# Altium project GrandMini_v1.PrjPcb (part 1 of 3)
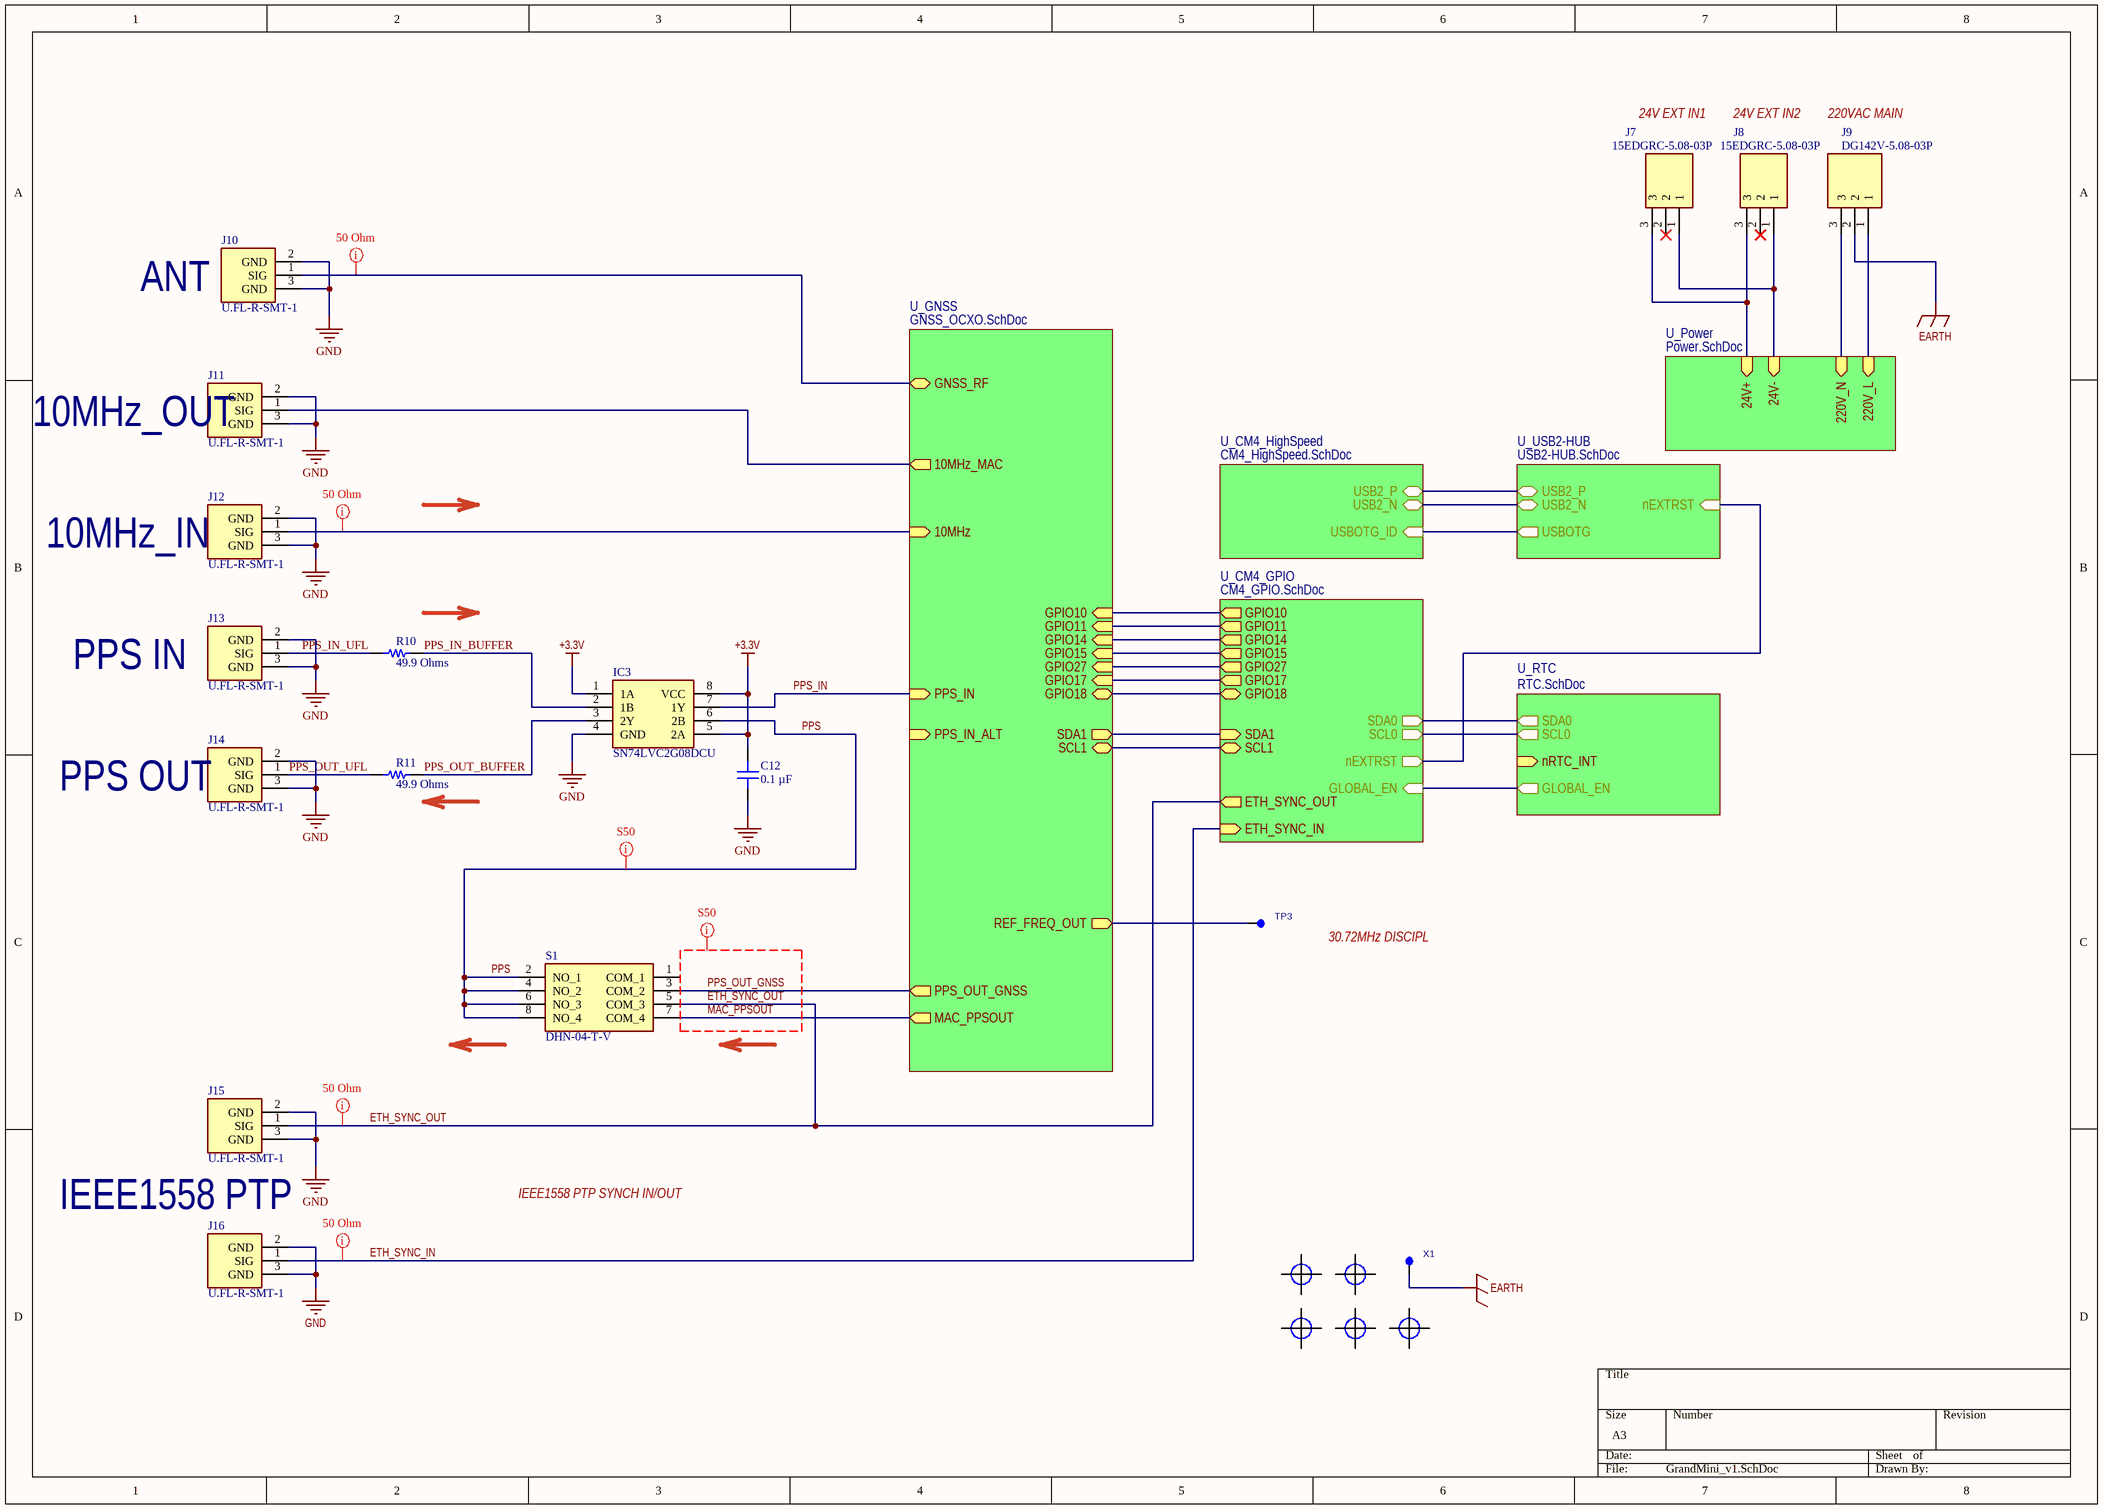
[diagram p0: GrandMini_v1.SchDoc]
TENSH_PCB: ТЕНШ.467883.02.11.001; TENSH_FAB: ТЕНШ.467883.02.11.000; revision: rev.1.0; company: SHIWA  NETWORK
7 sheets, 214 parts. Net scope: hierarchical (ports join the sheet entries above them; power ports are global).
Board file: GrandMini_v1.PcbDoc
Sheets:
  GrandMini_v1.SchDoc
    U_Power = Power.SchDoc
    U_CM4_GPIO = CM4_GPIO.SchDoc
    U_CM4_HighSpeed = CM4_HighSpeed.SchDoc
    U_RTC = RTC.SchDoc
    U_USB2-HUB = USB2-HUB.SchDoc
    U_GNSS = GNSS_OCXO.SchDoc

## Sheet GrandMini_v1.SchDoc
size A3; DocumentNumber: 1; SheetNumber: 1

### Parts
C12  0.1 µF  [CAP 0603_1608]
IC3  SN74LVC2G08DCU  [SOP50P310X90-8N]
J7  15EDGRC-5.08-03P  [15EDGRC-5.08-03P]
J8  15EDGRC-5.08-03P  [15EDGRC-5.08-03P]
J9  DG142V-5.08-03P  [DG142V-5.08-03P]
J10  U.FL-R-SMT-1  [U.FL-R-SMT-1]
J11  U.FL-R-SMT-1  [U.FL-R-SMT-1]
J12  U.FL-R-SMT-1  [U.FL-R-SMT-1]
J13  U.FL-R-SMT-1  [U.FL-R-SMT-1]
J14  U.FL-R-SMT-1  [U.FL-R-SMT-1]
J15  U.FL-R-SMT-1  [U.FL-R-SMT-1]
J16  U.FL-R-SMT-1  [U.FL-R-SMT-1]
MNT1  MOUNT_HOLE  [MOUNT_3.5mm]  (value not drawn)  (no BOM)
MNT2  MOUNT_HOLE  [MOUNT_3.5mm]  (value not drawn)  (no BOM)
MNT4  MOUNT_HOLE  [MOUNT_3.5mm]  (value not drawn)  (no BOM)
MNT5  MOUNT_HOLE  [MOUNT_3.5mm]  (value not drawn)  (no BOM)
MNT6  MOUNT_HOLE  [MOUNT_3.5mm]  (value not drawn)  (no BOM)
R10  49.9 Ohms  [YAGEO RES 0603_1608]
R11  49.9 Ohms  [YAGEO RES 0603_1608]
S1  DHN-04-T-V  [DHN04TV]
TP3  30.72MHz  [PAD_TEST]  (value not drawn)  (no BOM)
X1  PAD  [POWERPAD_ROU_7/3.2]  (value not drawn)  (no BOM)

### Sub-sheets
U_CM4_GPIO = CM4_GPIO.SchDoc: GLOBAL_EN (in), SCL0 (out), SDA0 (out), nEXTRST (out), SDA1 (in), SCL1 (bidir), ETH_SYNC_IN (in), ETH_SYNC_OUT (out), GPIO10 (out), GPIO11 (out), GPIO14 (out), GPIO15 (out), GPIO27 (out), GPIO17 (out), GPIO18 (bidir)
U_CM4_HighSpeed = CM4_HighSpeed.SchDoc: USBOTG_ID (in), USB2_P (bidir), USB2_N (bidir)
U_GNSS = GNSS_OCXO.SchDoc: 10MHz (in), GNSS_RF (bidir), PPS_IN_ALT (in), PPS_IN (in), GPIO17 (in), GPIO27 (in), GPIO11 (in), GPIO10 (in), REF_FREQ_OUT (out), PPS_OUT_GNSS (out), MAC_PPSOUT (out), GPIO15 (in), GPIO14 (in), GPIO18 (bidir), SDA1 (out), SCL1 (bidir), 10MHz_MAC (out)
U_Power = Power.SchDoc: 220V_L (in), 220V_N (in), 24V+ (in), 24V- (in)
U_RTC = RTC.SchDoc: SCL0 (out), SDA0 (out), GLOBAL_EN (out), nRTC_INT (in)
U_USB2-HUB = USB2-HUB.SchDoc: USB2_N (bidir), USBOTG (out), USB2_P (bidir), nEXTRST (in)

### Nets
+3.3V: C12.2 IC3.1(1A) IC3.5(2A) IC3.8(VCC)
EARTH: J9.2 X1.1
GND: C12.1 IC3.4(GND) J10.2(GND) J10.3(GND) J11.2(GND) J11.3(GND) J12.2(GND) J12.3(GND) J13.2(GND) J13.3(GND) J14.2(GND) J14.3(GND) J15.2(GND) J15.3(GND) J16.2(GND) J16.3(GND)
GND_ISO: J7.1 J8.1 ; sheet U_Power/24V-
10MHz: J12.1(SIG) ; sheet U_GNSS/10MHz
10MHz_MAC: J11.1(SIG) ; sheet U_GNSS/10MHz_MAC
24V+: J7.3 J8.3 ; sheet U_Power/24V+
220V_L: J9.1 ; sheet U_Power/220V_L
220V_N: J9.3 ; sheet U_Power/220V_N
ETH_SYNC_IN: J16.1(SIG) ; sheet U_CM4_GPIO/ETH_SYNC_IN
ETH_SYNC_OUT: J15.1(SIG) S1.5(COM_3) ; sheet U_CM4_GPIO/ETH_SYNC_OUT
GLOBAL_EN: sheet U_CM4_GPIO/GLOBAL_EN, sheet U_RTC/GLOBAL_EN
GNSS_RF_IN: J10.1(SIG) ; sheet U_GNSS/GNSS_RF
GPIO10: sheet U_CM4_GPIO/GPIO10, sheet U_GNSS/GPIO10
GPIO11: sheet U_CM4_GPIO/GPIO11, sheet U_GNSS/GPIO11
GPIO14: sheet U_CM4_GPIO/GPIO14, sheet U_GNSS/GPIO14
GPIO15: sheet U_CM4_GPIO/GPIO15, sheet U_GNSS/GPIO15
GPIO17: sheet U_CM4_GPIO/GPIO17, sheet U_GNSS/GPIO17
GPIO18: sheet U_CM4_GPIO/GPIO18, sheet U_GNSS/GPIO18
GPIO27: sheet U_CM4_GPIO/GPIO27, sheet U_GNSS/GPIO27
MAC_PPSOUT: S1.7(COM_4) ; sheet U_GNSS/MAC_PPSOUT
nEXTRST: sheet U_CM4_GPIO/nEXTRST, sheet U_USB2-HUB/nEXTRST
PPS: IC3.6(2B) S1.2(NO_1) S1.4(NO_2) S1.6(NO_3) S1.8(NO_4)
PPS_IN: IC3.7(1Y) ; sheet U_GNSS/PPS_IN
PPS_IN_BUFFER: IC3.2(1B) R10.2
PPS_IN_UFL: J13.1(SIG) R10.1
PPS_OUT_BUFFER: IC3.3(2Y) R11.2
PPS_OUT_GNSS: S1.3(COM_2) ; sheet U_GNSS/PPS_OUT_GNSS
PPS_OUT_UFL: J14.1(SIG) R11.1
REF_FREQ_OUT: TP3.1 ; sheet U_GNSS/REF_FREQ_OUT
SCL0: sheet U_CM4_GPIO/SCL0, sheet U_RTC/SCL0
SCL1: sheet U_CM4_GPIO/SCL1, sheet U_GNSS/SCL1
SDA0: sheet U_CM4_GPIO/SDA0, sheet U_RTC/SDA0
SDA1: sheet U_CM4_GPIO/SDA1, sheet U_GNSS/SDA1
USB2_N: sheet U_CM4_HighSpeed/USB2_N, sheet U_USB2-HUB/USB2_N
USB2_P: sheet U_CM4_HighSpeed/USB2_P, sheet U_USB2-HUB/USB2_P
USBOTG: sheet U_CM4_HighSpeed/USBOTG_ID, sheet U_USB2-HUB/USBOTG

Not connected (* = marked no-connect by the designer): J7 2*; J8 2*; S1 1(COM_1)

### Layout directives
net class RF: 10MHz, ETH_SYNC_IN, ETH_SYNC_OUT, GNSS_RF_IN
net class S50: ETH_SYNC_OUT, MAC_PPSOUT, PPS, PPS_OUT_GNSS

### Notes on the sheet
- 24V EXT IN1
- 24V EXT IN2
- 220VAC MAIN
- ANT
- (near J11) 10MHz_OUT
- (near J12) 10MHz_IN
- PPS IN
- (near J14) PPS OUT
- (near TP3) 30.72MHz DISCIPL
- IEEE1558 PTP SYNCH IN/OUT
- IEEE1558 PTP
- 1
- 2
- 3
- 4
- 5
- 6
- A
- B
- C
- www.raspberrypi.com <http://www.raspberrypi.com>
- D
- Title: Compute Module 4 IO Board - Top Level
- File: CM4IOv5.kicad_sch
- Sheet: /
- © 2020-2022 Raspberry Pi Ltd (formerly Raspberry Pi (Trading) Ltd.)
- KiCad E.D.A.  kicad (5.1.4)-1
- Size: A4
- Date:
- Rev: 1
- Id: 1/1

### Library data of the parts
C12 = CC0603KRX7R9BB104: CAP CER 0.1UF 50V X7R 0603; manufacturer: Yageo; Tolerance: ±10%; componentlink2url: https://www.digikey.com/en/products/detail/yageo/CC0603KRX7R9BB104/2103082; Value: 0.1 µF; componentlink2description: DigiKey Link; Temperature Coefficient: X7R; Capacitance: 0.1 µF; Part Number: CC0603KRX7R9BB104; Applications: General Purpose; componentlink1description: Datasheet; componentlink1url: https://www.yageo.com/upload/media/product/productsearch/datasheet/mlcc/UPY-GPHC_X7R_6.3V-to-50V_18.pdf; Device Package: 0603 (1608 Metric); lastupdated: 09.02.2024 20:10:21; Lifecycle Status: Active; Minimum Order: 1; Mounting Type: Surface Mount, MLCC; Operating Temperature: -55°C ~ 125°C; Package / Case: 0603 (1608 Metric); packaging: TapeAndReel; partid: 9506; Part Status: Active; price: 0.01; series: CC; Size / Dimension: 0.063" L x 0.031" W (1.60mm x 0.80mm); Supplier 1: DigiKey; Supplier Part Number 1: 311-1344-1-ND; Thickness (Max): 0.035" (0.90mm); Voltage - Rated: 50V
IC3 = SN74LVC2G08DCU: Integrated Circuit; Manufacturer_Name: Texas Instruments; Datasheet Link: https://datasheet.datasheetarchive.com/originals/distributors/Datasheets-SFU2/DSASFU100028333.pdf; Height: 0.9mm; Manufacturer_Part_Number: SN74LVC2G08DCU
J7 J8 = 15EDGRC-5.08-03P: Connector; Manufacturer_Name: Degson; Manufacturer_Part_Number: 15EDGRC-5.08-02P-14-00A(H); Height: 7.24mm
J9 = DG142V-5.08-03P_1: Connector; pin to pad: 1>1+4 2>2+5 3>3+6; Manufacturer_Name: Degson; Manufacturer_Part_Number: DG142V-5.08-02P; Datasheet Link: https://oss.degson.com/upload/pdf/20211003/20211003190604_7549.pdf; Height: 14.1mm
J10-J16 = U.FL-R-SMT-1: Connector; Manufacturer_Name: Hirose; Height: 1.5; Manufacturer_Part_Number: U.FL-R-SMT-1
MNT1 MNT2 MNT4-MNT6 = MOUNT_HOLE: Mount hole
R10 R11 = RC0603FR-0749R9L: RES 49.9 OHM 1% 1/10W 0603; Manufacturer: Yageo; Power (Watts): 0.1W, 1/10W; Temperature Coefficient: ±100ppm/°C; Packaging: CutTape; ComponentLink2Description: DigiKey Link; ComponentLink1Description: Datasheet; ComponentLink2URL: https://www.digikey.com/en/products/detail/yageo/RC0603FR-0749R9L/727264; ComponentLink1URL: https://www.yageo.com/upload/media/product/productsearch/datasheet/rchip/PYu-RC_Group_51_RoHS_L_10.pdf; Part Number: RC0603FR-0749R9L; Value: 49.9 Ohms; Composition: Thick Film; Device Package: 0603 (1608 Metric); Features: Moisture Resistant; Height - Seated (Max): 0.022" (0.55mm); LastUpdated: 25.07.2024 9:19:17; Lifecycle Status: Active; Minimum Order: 1; Number of Terminations: 2; Operating Temperature: -55°C ~ 155°C; Package / Case: 0603 (1608 Metric); PartId: 23951; Part Status: Active; Price: 0.01; Resistance: 49.9 Ohms; Series: RC_L; Size / Dimension: 0.063" L x 0.031" W (1.60mm x 0.80mm); Supplier 1: DigiKey; Supplier Part Number 1: 311-49.9HRCT-ND; Supplier Device Package: 0603; Tolerance: ±1%
S1 = DHN-04-T-V: Switch; Manufacturer_Name: Diptronics; Datasheet Link: https://componentsearchengine.com/Datasheets/1/DHN-04-T-V.pdf; Height: 1.65mm; Manufacturer_Part_Number: DHN-04-T-V; Mouser Part Number: 113-DHN04TV; Mouser Price/Stock: https://www.mouser.co.uk/ProductDetail/Diptronics/DHN-04-T-V?qs=MLItCLRbWswbt%252B1%2FkyC9JQ%3D%3D
TP3 = PAD_TEST: Test Point; Manufacturer: {Manufacturer}; Reseller3: {Reseller3}; Reseller1: {Reseller1}; Tempcoeff: {Tempcoeff}; Reseller2: {Reseller2}; Tolerance: {Tolerance}; Value: .NetName; PowerVoltage: {PowerVoltage}; CatalogueCode: {CatalogueCode}; Case: {Case}
X1 = PAD: Power Pad; Manufacturer: {Manufacturer}; Reseller3: {Reseller3}; Reseller1: {Reseller1}; Tempcoeff: {Tempcoeff}; Reseller2: {Reseller2}; Tolerance: {Tolerance}; Value: {Value}; PowerVoltage: {PowerVoltage}; CatalogueCode: {CatalogueCode}; Case: {Case}

## Sheet Power.SchDoc
size A3; DocumentNumber: 7; SheetNumber: 7
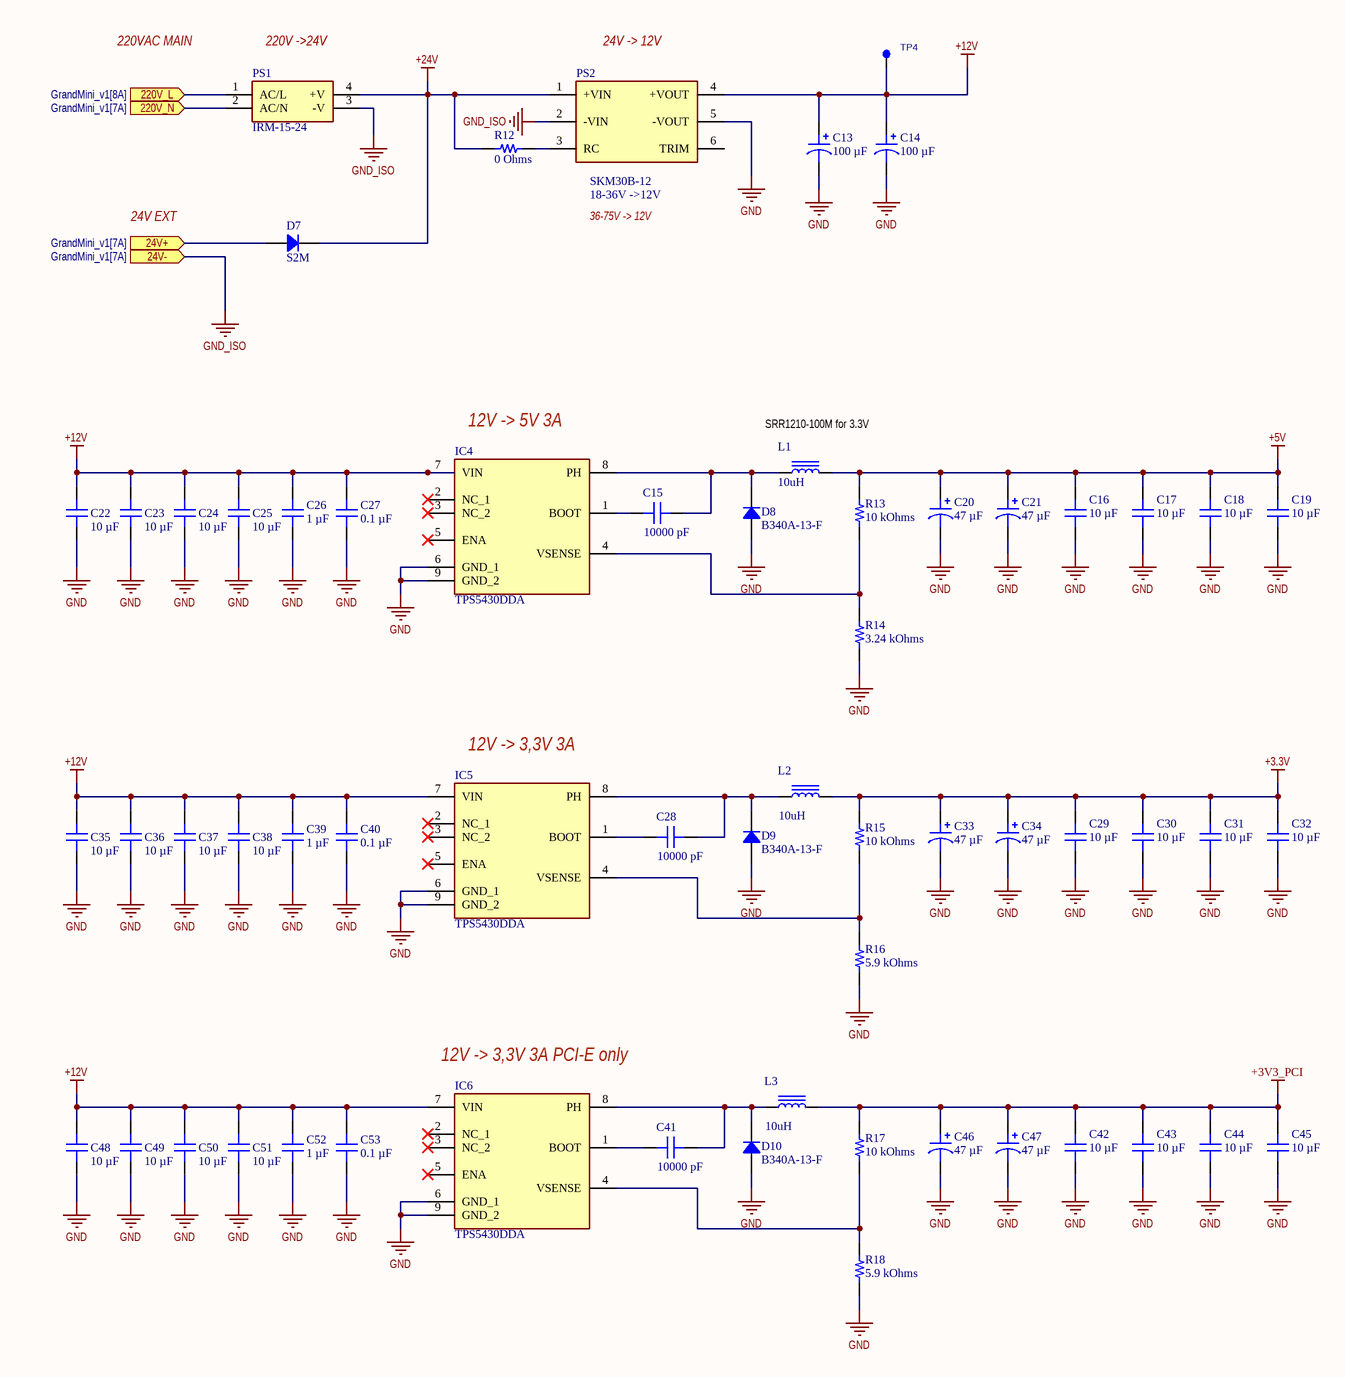
[diagram p1: Power.SchDoc]

### Parts
C13  100 µF  [CAP ALSMD 8.3MM H10.5MM]
C14  100 µF  [CAP ALSMD 8.3MM H10.5MM]
C15  10000 pF  [CAP 0603_1608]
C16  10 µF  [CAP 0805_2012]
C17  10 µF  [CAP 0805_2012]
C18  10 µF  [CAP 0805_2012]
C19  10 µF  [CAP 0805_2012]
C20  47 µF  [CAP POL 2917_7343]
C21  47 µF  [CAP POL 2917_7343]
C22  10 µF  [CAP 0805_2012]
C23  10 µF  [CAP 0805_2012]
C24  10 µF  [CAP 0805_2012]
C25  10 µF  [CAP 0805_2012]
C26  1 µF  [CAP 0603_1608]
C27  0.1 µF  [CAP 0603_1608]
C28  10000 pF  [CAP 0603_1608]
C29  10 µF  [CAP 0805_2012]
C30  10 µF  [CAP 0805_2012]
C31  10 µF  [CAP 0805_2012]
C32  10 µF  [CAP 0805_2012]
C33  47 µF  [CAP POL 2917_7343]
C34  47 µF  [CAP POL 2917_7343]
C35  10 µF  [CAP 0805_2012]
C36  10 µF  [CAP 0805_2012]
C37  10 µF  [CAP 0805_2012]
C38  10 µF  [CAP 0805_2012]
C39  1 µF  [CAP 0603_1608]
C40  0.1 µF  [CAP 0603_1608]
C41  10000 pF  [CAP 0603_1608]
C42  10 µF  [CAP 0805_2012]
C43  10 µF  [CAP 0805_2012]
C44  10 µF  [CAP 0805_2012]
C45  10 µF  [CAP 0805_2012]
C46  47 µF  [CAP POL 2917_7343]
C47  47 µF  [CAP POL 2917_7343]
C48  10 µF  [CAP 0805_2012]
C49  10 µF  [CAP 0805_2012]
C50  10 µF  [CAP 0805_2012]
C51  10 µF  [CAP 0805_2012]
C52  1 µF  [CAP 0603_1608]
C53  0.1 µF  [CAP 0603_1608]
D7  S2M  [DO214AA SMB]
D8  B340A-13-F  [DO214AC SMA]
D9  B340A-13-F  [DO214AC SMA]
D10  B340A-13-F  [DO214AC SMA]
IC4  TPS5430DDA  [SOIC127P600X170-9N]
IC5  TPS5430DDA  [SOIC127P600X170-9N]
IC6  TPS5430DDA  [SOIC127P600X170-9N]
L1  10uH  [XAL6060-103MEB]
L2  10uH  [XAL6060-103MEB]
L3  10uH  [XAL6060-103MEB]
PS1  IRM-15-24  [IRM-15]
PS2  18-36V ->12V  [SKM30]
R12  0 Ohms  [YAGEO RES 0603_1608]
R13  10 kOhms  [YAGEO RES 0603_1608]
R14  3.24 kOhms  [YAGEO RES 0603_1608]
R15  10 kOhms  [YAGEO RES 0603_1608]
R16  5.9 kOhms  [YAGEO RES 0603_1608]
R17  10 kOhms  [YAGEO RES 0603_1608]
R18  5.9 kOhms  [YAGEO RES 0603_1608]
TP4  PAD_TEST  [PAD_TEST]  (value not drawn)  (no BOM)

### Ports
24V+ (in, see GrandMini_v1[7A]), 24V- (in, see GrandMini_v1[7A]), 220V_L (in, see GrandMini_v1[8A]), 220V_N (in, see GrandMini_v1[7A])

### Nets
+3.3V: C29.2 C30.2 C31.2 C32.2 C33.1 C34.1 L2.2 R15.2
+3V3_PCI: C42.2 C43.2 C44.2 C45.2 C46.1 C47.1 L3.2 R17.2
+5V: C16.2 C17.2 C18.2 C19.2 C20.1 C21.1 L1.2 R13.2
+12V: C13.1 C14.1 C22.2 C23.2 C24.2 C25.2 C26.2 C27.2 C35.2 C36.2 C37.2 C38.2 C39.2 C40.2 C48.2 C49.2 C50.2 C51.2 C52.2 C53.2 IC4.7(VIN) IC5.7(VIN) IC6.7(VIN) PS2.4(+VOUT) TP4.1
+24V: D7.2 PS1.4(+V) PS2.1(+VIN) R12.1
GND: C13.2 C14.2 C16.1 C17.1 C18.1 C19.1 C20.2 C21.2 C22.1 C23.1 C24.1 C25.1 C26.1 C27.1 C29.1 C30.1 C31.1 C32.1 C33.2 C34.2 C35.1 C36.1 C37.1 C38.1 C39.1 C40.1 C42.1 C43.1 C44.1 C45.1 C46.2 C47.2 C48.1 C49.1 C50.1 C51.1 C52.1 C53.1 D8.1 D9.1 D10.1 IC4.6(GND_1) IC4.9(GND_2) IC5.6(GND_1) IC5.9(GND_2) IC6.6(GND_1) IC6.9(GND_2) PS2.5(-VOUT) R14.1 R16.1 R18.1
GND_ISO: PS1.3(-V) PS2.2(-VIN) ; port 24V-
24V+: D7.1 ; port 24V+
220V_L: PS1.1(AC/L) ; port 220V_L
220V_N: PS1.2(AC/N) ; port 220V_N
NetC15_1: C15.1 D8.2 IC4.8(PH) L1.1
NetC15_2: C15.2 IC4.1(BOOT)
NetC28_1: C28.1 D9.2 IC5.8(PH) L2.1
NetC28_2: C28.2 IC5.1(BOOT)
NetC41_1: C41.1 D10.2 IC6.8(PH) L3.1
NetC41_2: C41.2 IC6.1(BOOT)
NetIC4_4: IC4.4(VSENSE) R13.1 R14.2
NetIC5_4: IC5.4(VSENSE) R15.1 R16.2
NetIC6_4: IC6.4(VSENSE) R17.1 R18.2
NetPS2_3: PS2.3(RC) R12.2

Not connected (* = marked no-connect by the designer): IC4 2(NC_1)* 3(NC_2)* 5(ENA)*; IC5 2(NC_1)* 3(NC_2)* 5(ENA)*; IC6 2(NC_1)* 3(NC_2)* 5(ENA)*; PS2 6(TRIM)

### Notes on the sheet
- 220VAC MAIN
- (near PS1) 220V ->24V
- (near PS2) 24V -> 12V
- 24V EXT
- 36-75V -> 12V
- (near IC4) 12V -> 5V 3A
- (near L1) SRR1210-100M for 3.3V
- (near IC5) 12V -> 3,3V 3A
- (near IC6) 12V -> 3,3V 3A PCI-E only
- 1
- 2
- 3
- 4
- 5
- 6
- A
- B
- C
- www.raspberrypi.com <http://www.raspberrypi.com>
- D
- Title: Compute Module 4 IO Board - PSUs
- File: PSUs.kicad_sch
- Sheet: /
- © 2020-2022 Raspberry Pi Ltd (formerly Raspberry Pi (Trading) Ltd.)
- KiCad E.D.A.  kicad (5.1.4)-1
- Size: A4
- Date:
- Rev:
- Id: 1/1

### Library data of the parts
C13 C14 = EEE-FP1V101AL: CAP ALUM 100UF 20% 35V SMD; manufacturer: Panasonic Electronic Components; ESR (Equivalent Series Resistance): 80mOhm @ 100kHz; Lifetime @ Temp.: 2000 Hrs @ 105°C; Polarization: Polar; Ripple Current @ High Frequency: 850 mA @ 100 kHz; Ripple Current @ Low Frequency: 552.5 mA @ 120 Hz; Surface Mount Land Size: 0.327" L x 0.327" W (8.30mm x 8.30mm); Part Number: EEE-FP1V101AL; Applications: Automotive; Capacitance: 100 µF; componentlink1description: Datasheet; componentlink1url: https://na.industrial.panasonic.com/file-download/19633; componentlink2description: DigiKey Link; componentlink2url: https://www.digikey.com/en/products/detail/panasonic-electronic-components/EEE-FP1V101AL/12459641; Height - Seated (Max): 0.413" (10.50mm); lastupdated: 03.06.2024 20:15:43; Lifecycle Status: Active; Minimum Order: 1; Mounting Type: Surface Mount; Operating Temperature: -55°C ~ 105°C; packaging: TapeAndReel; partid: 27835; Part Status: Active; price: 0.28; Ratings: AEC-Q200; series: FP, Halogen Free; Size / Dimension: 0.315" Dia (8.00mm); Supplier 1: DigiKey; Supplier Part Number 1: 10-EEE-FP1V101ALCT-ND; Tolerance: ±20%; value: 100 µF; Voltage - Rated: 35 V
C15 C28 C41 = CC0603JRX7R9BB103: CAP CER 10000PF 50V X7R 0603; manufacturer: Yageo; Tolerance: ±5%; Supplier 1: DigiKey; Capacitance: 10000 pF; packaging: TapeAndReel; componentlink1url: https://www.yageo.com/upload/media/product/productsearch/datasheet/mlcc/UPY-GPHC_X7R_6.3V-to-50V_18.pdf; componentlink1description: Datasheet; componentlink2url: https://www.digikey.com/en/products/detail/yageo/CC0603JRX7R9BB103/5195187; componentlink2description: DigiKey Link; Supplier Part Number 1: 311-1778-1-ND; Part Number: CC0603JRX7R9BB103; Value: 10000 pF; Applications: General Purpose; Device Package: 0603 (1608 Metric); lastupdated: 09.02.2024 20:10:26; Lifecycle Status: Active; Minimum Order: 1; Mounting Type: Surface Mount, MLCC; Operating Temperature: -55°C ~ 125°C; Package / Case: 0603 (1608 Metric); partid: 5230; Part Status: Active; price: 0.01; series: CC; Size / Dimension: 0.063" L x 0.031" W (1.60mm x 0.80mm); Temperature Coefficient: X7R; Thickness (Max): 0.035" (0.90mm); Voltage - Rated: 50V
C16-C19 C22-C25 C29-C32 C35-C38 C42-C45 C48-C51 = CC0805KKX5R8BB106: CAP CER 10UF 25V X5R 0805; manufacturer: Yageo; Tolerance: ±10%; Value: 10 µF; Part Number: CC0805KKX5R8BB106; Applications: General Purpose; Capacitance: 10 µF; componentlink1description: Datasheet; componentlink1url: https://www.yageo.com/upload/media/product/productsearch/datasheet/mlcc/UPY-GPHC_X5R_4V-to-50V_25.pdf; componentlink2description: DigiKey Link; componentlink2url: https://www.digikey.com/en/products/detail/yageo/CC0805KKX5R8BB106/5195275; Device Package: 0805 (2012 Metric); lastupdated: 09.02.2024 20:15:28; Lifecycle Status: Active; Minimum Order: 1; Mounting Type: Surface Mount, MLCC; Operating Temperature: -55°C ~ 85°C; Package / Case: 0805 (2012 Metric); packaging: TapeAndReel; partid: 16151; Part Status: Active; price: 0.06; series: CC; Size / Dimension: 0.079" L x 0.049" W (2.00mm x 1.25mm); Supplier 1: DigiKey; Supplier Part Number 1: 311-1869-1-ND; Temperature Coefficient: X5R; Thickness (Max): 0.057" (1.45mm); Voltage - Rated: 25V
C20 C21 C33 C34 C46 C47 = T491X476K035AT: CAP TANT 47UF 10% 35V 2917; manufacturer: KEMET; Manufacturer Size Code: X; ESR (Equivalent Series Resistance): 600mOhm; Lifetime @ Temp.: 2000 Hrs @ 125°C; Type: Molded; Part Number: T491X476K035AT; Value: 47 µF; Capacitance: 47 µF; componentlink1description: Datasheet; componentlink1url: https://api.kemet.com/component-edge/download/datasheet/T491X476K035AT.pdf; componentlink2description: DigiKey Link; componentlink2url: https://www.digikey.com/en/products/detail/kemet/T491X476K035AT/818681; Device Package: 2917 (7343 Metric); Features: General Purpose; Height - Seated (Max): 0.169" (4.30mm); lastupdated: 03.06.2024 19:30:20; Lifecycle Status: Active; Minimum Order: 1; Mounting Type: Surface Mount; Operating Temperature: -55°C ~ 125°C; Package / Case: 2917 (7343 Metric); packaging: TapeAndReel; partid: 3168; Part Status: Active; price: 1.10; series: T491; Size / Dimension: 0.287" L x 0.169" W (7.30mm x 4.30mm); Supplier 1: DigiKey; Supplier Part Number 1: 399-3821-1-ND; Tolerance: ±10%; Voltage - Rated: 35 V
C26 C39 C52 = CC0603KRX7R9BB105: CAP CER 1UF 50V X7R 0603; manufacturer: Yageo; Tolerance: ±10%; Part Number: CC0603KRX7R9BB105; Value: 1 µF; Applications: General Purpose; Capacitance: 1 µF; componentlink1description: Datasheet; componentlink1url: https://www.yageo.com/upload/media/product/productsearch/datasheet/mlcc/UPY-GPHC_X7R_6.3V-to-50V_20.pdf; componentlink2description: DigiKey Link; componentlink2url: https://www.digikey.com/en/products/detail/yageo/CC0603KRX7R9BB105/5883796; Device Package: 0603 (1608 Metric); lastupdated: 09.02.2024 20:09:49; Lifecycle Status: Active; Minimum Order: 1; Mounting Type: Surface Mount, MLCC; Operating Temperature: -55°C ~ 125°C; Package / Case: 0603 (1608 Metric); packaging: TapeAndReel; partid: 45844; Part Status: Active; price: 0.09; series: CC; Size / Dimension: 0.063" L x 0.031" W (1.60mm x 0.80mm); Supplier 1: DigiKey; Supplier Part Number 1: 311-2082-1-ND; Temperature Coefficient: X7R; Thickness (Max): 0.035" (0.90mm); Voltage - Rated: 50V
C27 C40 C53 = CC0603KRX7R9BB104: as C12 on sheet GrandMini_v1; Part Number: CC0603KRX7R9BB104; Value: 0.1 µF; Applications: General Purpose; Capacitance: 0.1 µF; componentlink1description: Datasheet; componentlink1url: https://www.yageo.com/upload/media/product/productsearch/datasheet/mlcc/UPY-GPHC_X7R_6.3V-to-50V_18.pdf; componentlink2description: DigiKey Link; componentlink2url: https://www.digikey.com/en/products/detail/yageo/CC0603KRX7R9BB104/2103082; Device Package: 0603 (1608 Metric); lastupdated: 09.02.2024 20:10:21; Lifecycle Status: Active; Minimum Order: 1; Mounting Type: Surface Mount, MLCC; Operating Temperature: -55°C ~ 125°C; Package / Case: 0603 (1608 Metric); packaging: TapeAndReel; partid: 9506; Part Status: Active; price: 0.01; series: CC; Size / Dimension: 0.063" L x 0.031" W (1.60mm x 0.80mm); Supplier 1: DigiKey; Supplier Part Number 1: 311-1344-1-ND; Temperature Coefficient: X7R; Thickness (Max): 0.035" (0.90mm); Voltage - Rated: 50V
D7 = S2M: DIODE GEN PURP 1KV 2A DO214AA; Manufacturer: ON Semiconductor; Capacitance @ Vr, F: 30pF @ 4V, 1MHz; Current - Reverse Leakage @ Vr: 1µA @ 1000V; Diode Type: Standard; Reverse Recovery Time (trr): 2µs; Speed: Standard Recovery >500ns, > 200mA (Io); Voltage - DC Reverse (Vr) (Max): 1000V; Voltage - Forward (Vf) (Max) @ If: 1.15V @ 2A; Part Number: S2M; ComponentLink1Description: Datasheet; ComponentLink1URL: https://www.onsemi.com/pub/Collateral/S2M-D.pdf; ComponentLink2Description: DigiKey Link; ComponentLink2URL: http://digikey.com/product-detail/en/on-semiconductor/S2M/S2MFSCT-ND/2094442; Current - Average Rectified (Io): 2A; LastUpdated: 03.06.2024 19:53:56; Lifecycle Status: Active; Minimum Order: 1; Mounting Type: Surface Mount; Operating Temperature - Junction: -65°C ~ 150°C; Package / Case: DO-214AA, SMB; Packaging: TapeAndReel; PartId: 299; Part Status: Active; Price: 0.06; Series: -; Supplier 1: DigiKey; Supplier Part Number 1: S2MFSCT-ND; Supplier Device Package: DO-214AA (SMB)
D8-D10 = B340A-13-F: DIODE SCHOTTKY 40V 3A SMA; Manufacturer: Diodes Incorporated; Current - Reverse Leakage @ Vr: 500 µA @ 40 V; Speed: Fast Recovery =< 500ns, > 200mA (Io); Voltage - Forward (Vf) (Max) @ If: 500 mV @ 3 A; Capacitance @ Vr, F: 200pF @ 4V, 1MHz; Part Number: B340A-13-F; ComponentLink1Description: Datasheet; ComponentLink1URL: https://www.diodes.com/assets/Datasheets/ds30891.pdf; ComponentLink2Description: DigiKey Link; ComponentLink2URL: https://www.digikey.com/en/products/detail/diodes-incorporated/B340A-13-F/725015; Current - Average Rectified (Io): 3A; Diode Type: Schottky; LastUpdated: 03.06.2024 19:54:36; Lifecycle Status: Active; Minimum Order: 1; Mounting Type: Surface Mount; Operating Temperature - Junction: -55°C ~ 150°C; Package / Case: DO-214AC, SMA; Packaging: TapeAndReel; PartId: 1873; Part Status: Active; Price: 0.09; Series: -; Supplier 1: DigiKey; Supplier Part Number 1: B340A-FDICT-ND; Supplier Device Package: SMA; Voltage - DC Reverse (Vr) (Max): 40 V
IC4-IC6 = TPS5430DDA: Integrated Circuit; Manufacturer_Name: Texas Instruments; Datasheet Link: https://datasheet.datasheetarchive.com/originals/distributors/Datasheets-SFU2/DSASFU100034215.pdf; Height: 1.7mm; Manufacturer_Part_Number: TPS5430DDA; Mouser Part Number: 595-TPS5430DDA; Mouser Price/Stock: https://www.mouser.co.uk/ProductDetail/Texas-Instruments/TPS5430DDA?qs=zwk82MlA57bk5fOPRvfoCA%3D%3D; Arrow Part Number: TPS5430DDA; Arrow Price/Stock: https://www.arrow.com/en/products/tps5430dda/texas-instruments?region=nac
L1-L3 = XAL6060-103MEB: SMT Inductor; Value: 10uH
PS1 = IRM-15-24: Power Supply; Manufacturer_Name: Mean Well; Datasheet Link: https://componentsearchengine.com/Datasheets/2/IRM-15-24.pdf; Manufacturer_Part_Number: IRM-15-24; Mouser Part Number: 709-IRM15-24; Mouser Price/Stock: https://www.mouser.co.uk/ProductDetail/MEAN-WELL/IRM-15-24?qs=WkdRfq4wf1PZSEWhZtKDbQ%3D%3D; Arrow Part Number: IRM-15-24; Arrow Price/Stock: https://www.arrow.com/en/products/irm-15-24/mean-well-enterprises?utm_currency=USD&region=europe
PS2 = SKM30B-12: DC/DC, 30Вт, Uвх: 18-36В, Uвых: 12ВDC, Iвых: 2,5А / A: 9 ~ 18VDC B: 18 ~ 36VDC C: 36 ~ 75VDC; Manufacturer_Name: Mean Well; Datasheet Link: https://static.chipdip.ru/lib/784/DOC059784426.pdf; Height: 12; Manufacturer_Part_Number: SKM30B-12; Mouser Part Number: 709-DPU01N-12; Mouser Price/Stock: https://www.mouser.co.uk/ProductDetail/MEAN-WELL/DPU01N-12?qs=5aG0NVq1C4yTyMl3DWRvqA%3D%3D; Arrow Part Number: DPU01N-12; Arrow Price/Stock: https://www.arrow.com/en/products/dpu01n-12/mean-well-enterprises
R12 = RC0603FR-070RL: RES 0 OHM JUMPER 1/10W 0603; Manufacturer: Yageo; Power (Watts): 0.1W, 1/10W; Part Number: RC0603FR-070RL; Value: 0 Ohms; ComponentLink1Description: Datasheet; ComponentLink1URL: https://www.yageo.com/upload/media/product/productsearch/datasheet/rchip/PYu-RC_Group_51_RoHS_L_10.pdf; ComponentLink2Description: DigiKey Link; ComponentLink2URL: https://www.digikey.com/en/products/detail/yageo/RC0603FR-070RL/1304008; Composition: Thick Film; Device Package: 0603 (1608 Metric); Features: Moisture Resistant; Height - Seated (Max): 0.022" (0.55mm); LastUpdated: 25.07.2024 9:19:19; Lifecycle Status: Active; Minimum Order: 1; Number of Terminations: 2; Operating Temperature: -55°C ~ 155°C; Package / Case: 0603 (1608 Metric); Packaging: CutTape; PartId: 22614; Part Status: Active; Price: 0.01; Resistance: 0 Ohms; Series: RC_L; Size / Dimension: 0.063" L x 0.031" W (1.60mm x 0.80mm); Supplier 1: DigiKey; Supplier Part Number 1: 311-0.0HRCT-ND; Supplier Device Package: 0603; Tolerance: Jumper
R13 R15 R17 = RC0603FR-0710KL: RES 10K OHM 1% 1/10W 0603; Manufacturer: Yageo; Power (Watts): 0.1W, 1/10W; Temperature Coefficient: ±100ppm/°C; Part Number: RC0603FR-0710KL; Value: 10 kOhms; ComponentLink1Description: Datasheet; ComponentLink1URL: https://www.yageo.com/upload/media/product/productsearch/datasheet/rchip/PYu-RC_Group_51_RoHS_L_10.pdf; ComponentLink2Description: DigiKey Link; ComponentLink2URL: https://www.digikey.com/en/products/detail/yageo/RC0603FR-0710KL/726880; Composition: Thick Film; Device Package: 0603 (1608 Metric); Features: Moisture Resistant; Height - Seated (Max): 0.022" (0.55mm); LastUpdated: 25.07.2024 9:19:19; Lifecycle Status: Active; Minimum Order: 1; Number of Terminations: 2; Operating Temperature: -55°C ~ 155°C; Package / Case: 0603 (1608 Metric); Packaging: CutTape; PartId: 22599; Part Status: Active; Price: 0.01; Resistance: 10 kOhms; Series: RC_L; Size / Dimension: 0.063" L x 0.031" W (1.60mm x 0.80mm); Supplier 1: DigiKey; Supplier Part Number 1: 311-10.0KHRCT-ND; Supplier Device Package: 0603; Tolerance: ±1%
R14 = RC0603FR-073K24L: RES 3.24K OHM 1% 1/10W 0603; Manufacturer: Yageo; Power (Watts): 0.1W, 1/10W; Temperature Coefficient: ±100ppm/°C; Part Number: RC0603FR-073K24L; Value: 3.24 kOhms; ComponentLink1Description: Datasheet; ComponentLink1URL: https://www.yageo.com/upload/media/product/productsearch/datasheet/rchip/PYu-RC_Group_51_RoHS_L_10.pdf; ComponentLink2Description: DigiKey Link; ComponentLink2URL: https://www.digikey.com/en/products/detail/yageo/RC0603FR-073K24L/727125; Composition: Thick Film; Device Package: 0603 (1608 Metric); Features: Moisture Resistant; Height - Seated (Max): 0.022" (0.55mm); LastUpdated: 25.07.2024 9:19:27; Lifecycle Status: Active; Minimum Order: 1; Number of Terminations: 2; Operating Temperature: -55°C ~ 155°C; Package / Case: 0603 (1608 Metric); Packaging: CutTape; PartId: 12479; Part Status: Active; Price: 0.01; Resistance: 3.24 kOhms; Series: RC_L; Size / Dimension: 0.063" L x 0.031" W (1.60mm x 0.80mm); Supplier 1: DigiKey; Supplier Part Number 1: 311-3.24KHRCT-ND; Supplier Device Package: 0603; Tolerance: ±1%
R16 R18 = RC0603FR-075K9L: RES 5.9K OHM 1% 1/10W 0603; Manufacturer: Yageo; Power (Watts): 0.1W, 1/10W; Temperature Coefficient: ±100ppm/°C; Part Number: RC0603FR-075K9L; Value: 5.9 kOhms; ComponentLink1Description: Datasheet; ComponentLink1URL: https://www.yageo.com/upload/media/product/productsearch/datasheet/rchip/PYu-RC_Group_51_RoHS_L_10.pdf; ComponentLink2Description: DigiKey Link; ComponentLink2URL: https://www.digikey.com/en/products/detail/yageo/RC0603FR-075K9L/727280; Composition: Thick Film; Device Package: 0603 (1608 Metric); Features: Moisture Resistant; Height - Seated (Max): 0.022" (0.55mm); LastUpdated: 25.07.2024 9:19:27; Lifecycle Status: Active; Minimum Order: 1; Number of Terminations: 2; Operating Temperature: -55°C ~ 155°C; Package / Case: 0603 (1608 Metric); Packaging: CutTape; PartId: 12481; Part Status: Active; Price: 0.01; Resistance: 5.9 kOhms; Series: RC_L; Size / Dimension: 0.063" L x 0.031" W (1.60mm x 0.80mm); Supplier 1: DigiKey; Supplier Part Number 1: 311-5.90KHRCT-ND; Supplier Device Package: 0603; Tolerance: ±1%
TP4 = PAD_TEST: as TP3 on sheet GrandMini_v1; Case: {Case}

## Sheet CM4_GPIO.SchDoc
size A3; DocumentNumber: 2; SheetNumber: 2
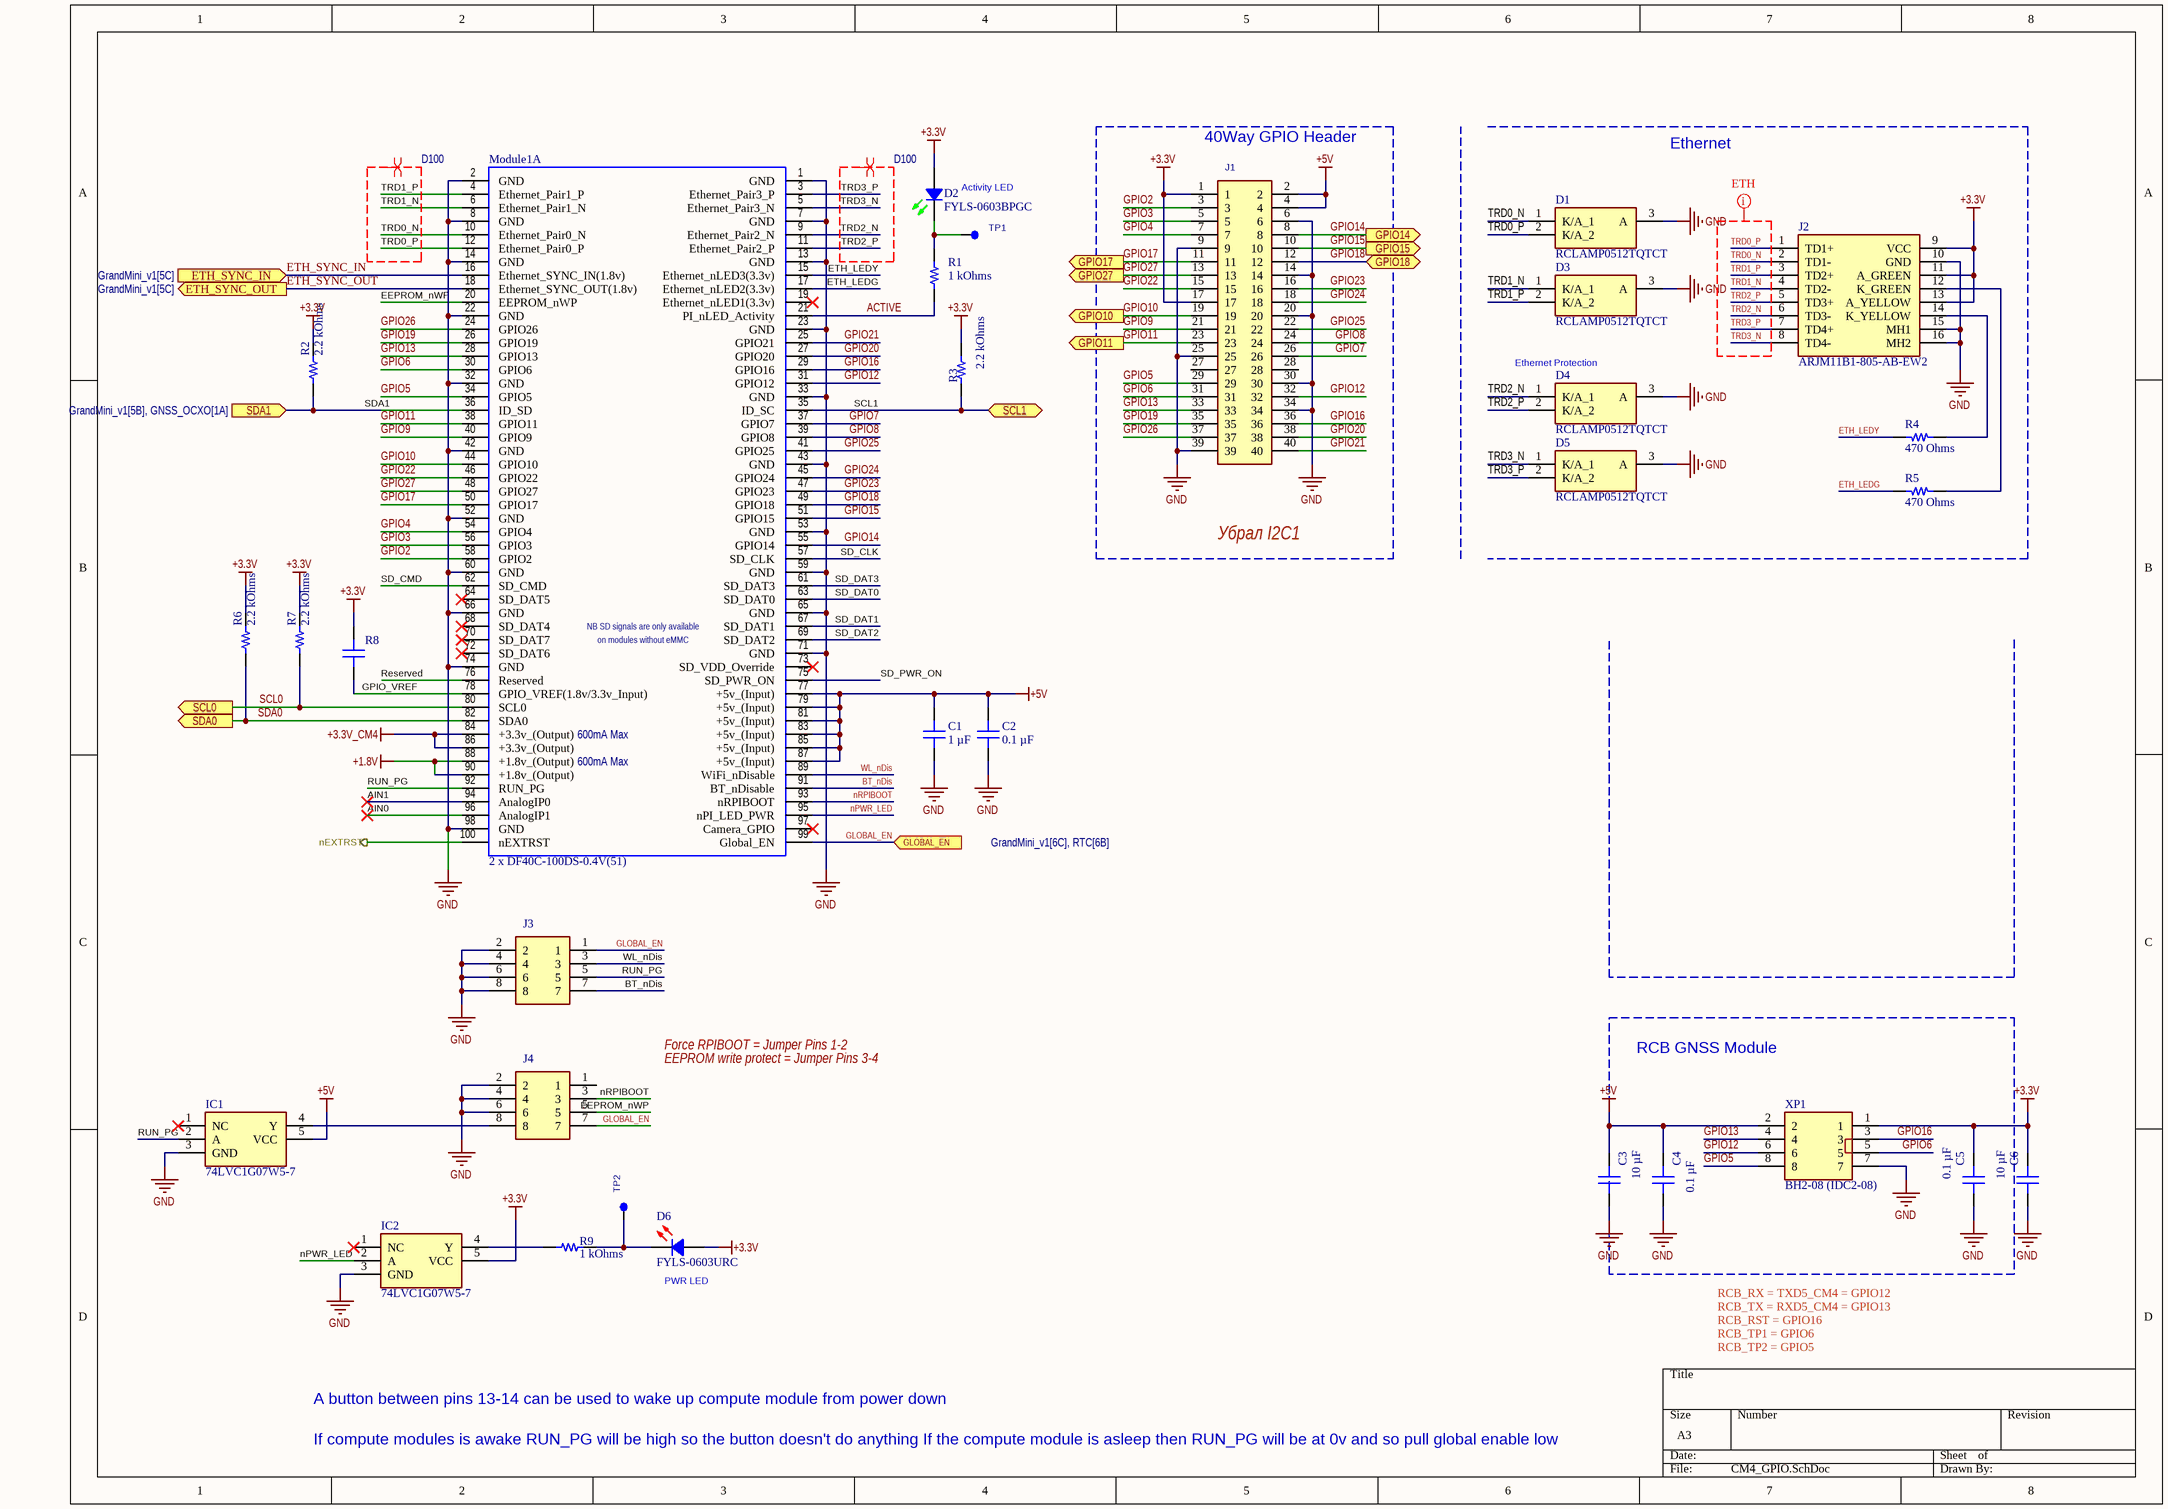
[diagram p2: CM4_GPIO.SchDoc]

### Parts
C1  1 µF  [CAP 0603_1608]
C2  0.1 µF  [CAP 0603_1608]
C3  10 µF  [CAP 0805_2012]
C4  0.1 µF  [CAP 0603_1608]
C5  0.1 µF  [CAP 0603_1608]
C6  10 µF  [CAP 0805_2012]
D1  RCLAMP0512TQTCT  [RCLAMP0512TQTCT]
D2  FYLS-0603BPGC  [LEDC1608X55N_GREEN]
D3  RCLAMP0512TQTCT  [RCLAMP0512TQTCT]
D4  RCLAMP0512TQTCT  [RCLAMP0512TQTCT]
D5  RCLAMP0512TQTCT  [RCLAMP0512TQTCT]
D6  FYLS-0603URC  [LEDC1608X55N_RED]
IC1  74LVC1G07W5-7  [SOT95P285X140-5N]
IC2  74LVC1G07W5-7  [SOT95P285X140-5N]
J1  PBD-40  [PBD-40]  (value not drawn)
J2  ARJM11B1-805-AB-EW2  [ARJM11B1805ABEW2]
J3  PLD-8  [PLD-8]  (value not drawn)
J4  PLD-8  [PLD-8]  (value not drawn)
Module1  2 x DF40C-100DS-0.4V(51)  [RPI_CM4_STACKED]  (part A of 2)
R1  1 kOhms  [YAGEO RES 0603_1608]
R2  2.2 kOhms  [YAGEO RES 0402_1005]
R3  2.2 kOhms  [YAGEO RES 0402_1005]
R4  470 Ohms  [YAGEO RES 0402_1005]
R5  470 Ohms  [YAGEO RES 0402_1005]
R6  2.2 kOhms  [YAGEO RES 0402_1005]
R7  2.2 kOhms  [YAGEO RES 0402_1005]
R8  10 µF  [CAP 0805_2012]  (value not drawn)
R9  1 kOhms  [YAGEO RES 0603_1608]
TP1  PAD_TEST  [PAD_TEST]  (value not drawn)  (no BOM)
TP2  PAD_TEST  [PAD_TEST]  (value not drawn)  (no BOM)
XP1  BH2-08 (IDC2-08)  [BH2-08]

### Blocks framed on the sheet
Убрал I2C1: J1
RCB GNSS Module: C3-C5 XP1

### Ports
ETH_SYNC_IN (in, see GrandMini_v1[5C]), ETH_SYNC_OUT (out, see GrandMini_v1[5C]), GLOBAL_EN (in, see GrandMini_v1[6C], RTC[6B]), GPIO10 (out, see GrandMini_v1[5B], GNSS_OCXO[3A]), GPIO11 (out, see GrandMini_v1[5B], GNSS_OCXO[3A]), GPIO14 (out, see GrandMini_v1[5B], GNSS_OCXO[3A]), GPIO15 (out, see GrandMini_v1[5B], GNSS_OCXO[3A]), GPIO17 (out, see GrandMini_v1[5B], GNSS_OCXO[1B]), GPIO18 (bidir, see GrandMini_v1[5B], GNSS_OCXO[3A]), GPIO27 (out, see GrandMini_v1[5B], GNSS_OCXO[1B]), nEXTRST (out, see GrandMini_v1[6C], USB2-HUB[1B]), SCL0 (out, see GrandMini_v1[6B], RTC[3A]), SCL1 (bidir, see GrandMini_v1[5B], GNSS_OCXO[1A]), SDA0 (out, see GrandMini_v1[6B], RTC[3B]), SDA1 (in, see GrandMini_v1[5B], GNSS_OCXO[1A])

### Nets
+1.8V: Module1.88(+1.8v_(Output)) Module1.90(+1.8v_(Output))
+3.3V: C5.2 C6.2 D2.2(C) D6.2(C) IC2.5(VCC) J1.1 J1.17 J2.9(VCC) J2.11(A_GREEN) J2.13(A_YELLOW) R2.2 R3.2 R6.2 R7.2 R8.2 XP1.1
+3.3V_CM4: Module1.84(+3.3v_(Output)) Module1.86(+3.3v_(Output))
+5V: C1.2 C2.2 C3.2 C4.2 IC1.5(VCC) J1.2 J1.4 Module1.77(+5v_(Input)) Module1.79(+5v_(Input)) Module1.81(+5v_(Input)) Module1.83(+5v_(Input)) Module1.85(+5v_(Input)) Module1.87(+5v_(Input)) XP1.2
GND: C1.1 C2.1 C3.1 C4.1 C5.1 C6.1 D1.3(A) D3.3(A) D4.3(A) D5.3(A) IC1.3(GND) IC2.3(GND) J1.6 J1.9 J1.14 J1.20 J1.25 J1.30 J1.34 J1.39 J2.10(GND) J2.15(MH1) J2.16(MH2) J3.2 J3.4 J3.6 J3.8 J4.2 J4.4 J4.6 Module1.1(GND) Module1.2(GND) Module1.7(GND) Module1.8(GND) Module1.13(GND) Module1.14(GND) Module1.22(GND) Module1.23(GND) Module1.32(GND) Module1.33(GND) Module1.42(GND) Module1.43(GND) Module1.52(GND) Module1.53(GND) Module1.59(GND) Module1.60(GND) Module1.65(GND) Module1.66(GND) Module1.71(GND) Module1.74(GND) Module1.98(GND) XP1.7
ACTIVE: Module1.21(PI_nLED_Activity) R1.1
AIN0: Module1.96(AnalogIP1)
AIN1: Module1.94(AnalogIP0)
BT_nDis: J3.7 Module1.91(BT_nDisable)
EEPROM_nWP: J4.5 Module1.20(EEPROM_nWP)
ETH_LEDG: Module1.17(Ethernet_nLED2(3.3v)) R5.2
ETH_LEDY: Module1.15(Ethernet_nLED3(3.3v)) R4.2
ETH_SYNC_IN: Module1.16(Ethernet_SYNC_IN(1.8v)) ; port ETH_SYNC_IN
ETH_SYNC_OUT: Module1.18(Ethernet_SYNC_OUT(1.8v)) ; port ETH_SYNC_OUT
GLOBAL_EN: J3.1 J4.7 Module1.99(Global_EN) ; port GLOBAL_EN
GPIO2: J1.3 Module1.58(GPIO2)
GPIO3: J1.5 Module1.56(GPIO3)
GPIO4: J1.7 Module1.54(GPIO4)
GPIO5: J1.29 Module1.34(GPIO5) XP1.8
GPIO6: J1.31 Module1.30(GPIO6) XP1.5
GPIO7: J1.26 Module1.37(GPIO7)
GPIO8: J1.24 Module1.39(GPIO8)
GPIO9: J1.21 Module1.40(GPIO9)
GPIO10: J1.19 Module1.44(GPIO10) ; port GPIO10
GPIO11: J1.23 Module1.38(GPIO11) ; port GPIO11
GPIO12: J1.32 Module1.31(GPIO12) XP1.6
GPIO13: J1.33 Module1.28(GPIO13) XP1.4
GPIO14: J1.8 Module1.55(GPIO14) ; port GPIO14
GPIO15: J1.10 Module1.51(GPIO15) ; port GPIO15
GPIO16: J1.36 Module1.29(GPIO16) XP1.3
GPIO17: J1.11 Module1.50(GPIO17) ; port GPIO17
GPIO18: J1.12 Module1.49(GPIO18) ; port GPIO18
GPIO19: J1.35 Module1.26(GPIO19)
GPIO20: J1.38 Module1.27(GPIO20)
GPIO21: J1.40 Module1.25(GPIO21)
GPIO22: J1.15 Module1.46(GPIO22)
GPIO23: J1.16 Module1.47(GPIO23)
GPIO24: J1.18 Module1.45(GPIO24)
GPIO25: J1.22 Module1.41(GPIO25)
GPIO26: J1.37 Module1.24(GPIO26)
GPIO27: J1.13 Module1.48(GPIO27) ; port GPIO27
GPIO_VREF: Module1.78(GPIO_VREF(1.8v/3.3v_Input)) R8.1
nEXTRST: Module1.100(nEXTRST) ; port nEXTRST
nPWR_LED: IC2.2(A) Module1.95(nPI_LED_PWR)
nRPIBOOT: J4.3 Module1.93(nRPIBOOT)
RUN_PG: IC1.2(A) J3.5 Module1.92(RUN_PG)
SCL0: Module1.80(SCL0) R7.1 ; port SCL0
SCL1: Module1.35(ID_SC) R3.1 ; port SCL1
SD_CLK: Module1.57(SD_CLK)
SD_CMD: Module1.62(SD_CMD)
SD_DAT0: Module1.63(SD_DAT0)
SD_DAT1: Module1.67(SD_DAT1)
SD_DAT2: Module1.69(SD_DAT2)
SD_DAT3: Module1.61(SD_DAT3)
SD_PWR_ON: Module1.75(SD_PWR_ON)
SDA0: Module1.82(SDA0) R6.1 ; port SDA0
SDA1: Module1.36(ID_SD) R2.1 ; port SDA1
TRD0_N: D1.1(K/A_1) J2.2(TD1-) Module1.10(Ethernet_Pair0_N)
TRD0_P: D1.2(K/A_2) J2.1(TD1+) Module1.12(Ethernet_Pair0_P)
TRD1_N: D3.1(K/A_1) J2.4(TD2-) Module1.6(Ethernet_Pair1_N)
TRD1_P: D3.2(K/A_2) J2.3(TD2+) Module1.4(Ethernet_Pair1_P)
TRD2_N: D4.1(K/A_1) J2.6(TD3-) Module1.9(Ethernet_Pair2_N)
TRD2_P: D4.2(K/A_2) J2.5(TD3+) Module1.11(Ethernet_Pair2_P)
TRD3_N: D5.1(K/A_1) J2.8(TD4-) Module1.5(Ethernet_Pair3_N)
TRD3_P: D5.2(K/A_2) J2.7(TD4+) Module1.3(Ethernet_Pair3_P)
WL_nDis: J3.3 Module1.89(WiFi_nDisable)
NetD2_1: D2.1(A) R1.2 TP1.1
NetD6_1: D6.1(A) R9.2 TP2.1
NetIC1_4: IC1.4(Y) J4.8
NetIC2_4: IC2.4(Y) R9.1
NetJ2_12: J2.12(K_GREEN) R5.1
NetJ2_14: J2.14(K_YELLOW) R4.1

Not connected (* = marked no-connect by the designer): IC1 1(NC)*; IC2 1(NC)*; J1 27 28; J4 1; Module1 19(Ethernet_nLED1(3.3v))* 64(SD_DAT5)* 68(SD_DAT4)* 70(SD_DAT7)* 72(SD_DAT6)* 73(SD_VDD_Override)* 76(Reserved) 97(Camera_GPIO)*

### Layout directives
differential pair; differential pair class D100: TRD0_N, TRD0_P, TRD1_N, TRD1_P, TRD2_N, TRD2_P, TRD3_N, TRD3_P
net class ETH: TRD0_N, TRD0_P, TRD1_N, TRD1_P, TRD2_N, TRD2_P, TRD3_N, TRD3_P

### Notes on the sheet
- (near J1) 40Way GPIO Header
- Ethernet
- Activity LED
- (near D4) Ethernet
  Protection
- Force RPIBOOT = Jumper Pins 1-2
- EEPROM write protect = Jumper Pins 3-4
- (near D6) PWR LED
- RCB_TX = RXD5_CM4 = GPIO13
- RCB_RX = TXD5_CM4 = GPIO12
- RCB_RST = GPIO16
- RCB_TP1 = GPIO6
- RCB_TP2 = GPIO5
- A button between pins 13-14 can be used to wake up compute module from power down
- If compute modules is awake RUN_PG will be high so the button doesn't do anything
  If the compute module is asleep then RUN_PG will be at 0v and so pull global enable low
- Labels drawn without touching a wire or pin: Reserved
- 1
- 2
- 3
- 4
- 5
- 6
- A
- B
- C
- www.raspberrypi.com <http://www.raspberrypi.com>
- D
- Title: Compute Module 4 IO Board - GPIO - Ethernet
- File: CM4_GPIO.kicad_sch
- Sheet: /
- © 2020-2022 Raspberry Pi Ltd (formerly Raspberry Pi (Trading) Ltd.)
- KiCad E.D.A.  kicad (5.1.4)-1
- Size: A4
- Date:
- Rev: 1
- Id: 1/1
- (in symbol RPi_CM4_1, part A) NB SD signals are only available; on modules without eMMC; 600mA Max

### Library data of the parts
C1 = CC0603KRX7R9BB105: as C26 on sheet Power; Part Number: CC0603KRX7R9BB105; Value: 1 µF; Applications: General Purpose; Capacitance: 1 µF; componentlink1description: Datasheet; componentlink1url: https://www.yageo.com/upload/media/product/productsearch/datasheet/mlcc/UPY-GPHC_X7R_6.3V-to-50V_20.pdf; componentlink2description: DigiKey Link; componentlink2url: https://www.digikey.com/en/products/detail/yageo/CC0603KRX7R9BB105/5883796; Device Package: 0603 (1608 Metric); lastupdated: 09.02.2024 20:09:49; Lifecycle Status: Active; Minimum Order: 1; Mounting Type: Surface Mount, MLCC; Operating Temperature: -55°C ~ 125°C; Package / Case: 0603 (1608 Metric); packaging: TapeAndReel; partid: 45844; Part Status: Active; price: 0.09; series: CC; Size / Dimension: 0.063" L x 0.031" W (1.60mm x 0.80mm); Supplier 1: DigiKey; Supplier Part Number 1: 311-2082-1-ND; Temperature Coefficient: X7R; Thickness (Max): 0.035" (0.90mm); Voltage - Rated: 50V
C2 C4 C5 = CC0603KRX7R9BB104: as C12 on sheet GrandMini_v1; Part Number: CC0603KRX7R9BB104; Value: 0.1 µF; Applications: General Purpose; Capacitance: 0.1 µF; componentlink1description: Datasheet; componentlink1url: https://www.yageo.com/upload/media/product/productsearch/datasheet/mlcc/UPY-GPHC_X7R_6.3V-to-50V_18.pdf; componentlink2description: DigiKey Link; componentlink2url: https://www.digikey.com/en/products/detail/yageo/CC0603KRX7R9BB104/2103082; Device Package: 0603 (1608 Metric); lastupdated: 09.02.2024 20:10:21; Lifecycle Status: Active; Minimum Order: 1; Mounting Type: Surface Mount, MLCC; Operating Temperature: -55°C ~ 125°C; Package / Case: 0603 (1608 Metric); packaging: TapeAndReel; partid: 9506; Part Status: Active; price: 0.01; series: CC; Size / Dimension: 0.063" L x 0.031" W (1.60mm x 0.80mm); Supplier 1: DigiKey; Supplier Part Number 1: 311-1344-1-ND; Temperature Coefficient: X7R; Thickness (Max): 0.035" (0.90mm); Voltage - Rated: 50V
C3 C6 R8 = CC0805KKX5R8BB106: as C16 on sheet Power; Value: 10 µF; Part Number: CC0805KKX5R8BB106; Applications: General Purpose; Capacitance: 10 µF; componentlink1description: Datasheet; componentlink1url: https://www.yageo.com/upload/media/product/productsearch/datasheet/mlcc/UPY-GPHC_X5R_4V-to-50V_25.pdf; componentlink2description: DigiKey Link; componentlink2url: https://www.digikey.com/en/products/detail/yageo/CC0805KKX5R8BB106/5195275; Device Package: 0805 (2012 Metric); lastupdated: 09.02.2024 20:15:28; Lifecycle Status: Active; Minimum Order: 1; Mounting Type: Surface Mount, MLCC; Operating Temperature: -55°C ~ 85°C; Package / Case: 0805 (2012 Metric); packaging: TapeAndReel; partid: 16151; Part Status: Active; price: 0.06; series: CC; Size / Dimension: 0.079" L x 0.049" W (2.00mm x 1.25mm); Supplier 1: DigiKey; Supplier Part Number 1: 311-1869-1-ND; Temperature Coefficient: X5R; Thickness (Max): 0.057" (1.45mm); Voltage - Rated: 25V
D1 D3-D5 = RCLAMP0512TQTCT: Diode; Manufacturer_Name: SEMTECH; Datasheet Link: https://media.digikey.com/pdf/Data%20Sheets/Semtech%20PDFs/RCLAMP0512TQ_Rev6_12-17-15.pdf; Height: 0.45mm; Manufacturer_Part_Number: RCLAMP0512TQTCT; Mouser Part Number: 947-RCLAMP0512TQTCT; Mouser Price/Stock: https://www.mouser.co.uk/ProductDetail/Semtech/RCLAMP0512TQTCT?qs=rBWM4%252BvDhIfq7vcNOg1BvQ%3D%3D; Arrow Part Number: RCLAMP0512TQTCT; Arrow Price/Stock: https://www.arrow.com/en/products/rclamp0512tqtct/semtech?utm_currency=USD&region=europe
D2 = FYLS-0603BPGC: LED, 0603, GREEN; Manufacturer_Name: FORYARD; Datasheet Link: https://v4.cecdn.yun300.cn/100001_2003185297/7%20FYLS-0603BXXXC-D.pdf; Height: 0.6mm; Manufacturer_Part_Number: FYLS-0603BPGC
D6 = FYLS-0603URC: LED, 0603, RED; Manufacturer_Name: FORYARD; Datasheet Link: https://v4.cecdn.yun300.cn/100001_2003185297/7%20FYLS-0603BXXXC-D.pdf; Height: 0.6mm; Manufacturer_Part_Number: FYLS-0603URC
IC1 IC2 = 74LVC1G07W5-7: Integrated Circuit; Manufacturer_Name: Diodes Incorporated; Datasheet Link: https://www.diodes.com//assets/Datasheets/74LVC1G07.pdf; Height: 1.4mm; Manufacturer_Part_Number: 74LVC1G07W5-7; Mouser Part Number: 621-74LVC1G07W5-7; Mouser Price/Stock: https://www.mouser.co.uk/ProductDetail/Diodes-Incorporated/74LVC1G07W5-7?qs=abZ1nkZpTuMhe1bWQEjvtw%3D%3D; Arrow Part Number: 74LVC1G07W5-7; Arrow Price/Stock: https://www.arrow.com/en/products/74lvc1g07w5-7/diodes-incorporated?utm_currency=USD&region=nac
J1 = PBD-40: Connector; Manufacturer: Connfly; Part Number1: DS-1023-2x20; System: Connector; Part Number: PBD-40
J2 = ARJM11B1-805-AB-EW2: Connector; Manufacturer_Name: ABRACON; Datasheet Link: https://abracon.com/Magnetics/ARJM11.pdf; Height: 13.75mm; Manufacturer_Part_Number: ARJM11B1-805-AB-EW2; Mouser Part Number: 815-RJM11B1805ABEW2; Mouser Price/Stock: https://www.mouser.co.uk/ProductDetail/ABRACON/ARJM11B1-805-AB-EW2?qs=YCa%2FAAYMW02bp%252BSCNzjdNA%3D%3D; Arrow Part Number: ARJM11B1-805-AB-EW2; Arrow Price/Stock: https://www.arrow.com/en/products/arjm11b1-805-ab-ew2/abracon?region=nac
J3 J4 = PLD-8_1: Connector; Manufacturer_Name: JST (JAPAN SOLDERLESS TERMINALS); Manufacturer_Part_Number: S4B-PH-SM4-TB(LF)(SN); Datasheet Link: http://uk.rs-online.com/web/p/products/6881366; Arrow Part Number: S4B-PH-SM4-TB(LF)(SN); Arrow Price/Stock: https://www.arrow.com/en/products/s4b-ph-sm4-tb-lf-sn/jst-manufacturing; System: Connector
Module1 = RPi_CM4_1: Rapsberry PI Compute Module 4 +
R1 R9 = RC0603FR-071KL: RES 1K OHM 1% 1/10W 0603; Manufacturer: Yageo; Power (Watts): 0.1W, 1/10W; Temperature Coefficient: ±100ppm/°C; Value: 1 kOhms; Part Number: RC0603FR-071KL; ComponentLink1Description: Datasheet; ComponentLink1URL: https://www.yageo.com/upload/media/product/productsearch/datasheet/rchip/PYu-RC_Group_51_RoHS_L_10.pdf; ComponentLink2Description: DigiKey Link; ComponentLink2URL: https://www.digikey.com/en/products/detail/yageo/RC0603FR-071KL/726843; Composition: Thick Film; Device Package: 0603 (1608 Metric); Features: Moisture Resistant; Height - Seated (Max): 0.022" (0.55mm); LastUpdated: 25.07.2024 9:19:19; Lifecycle Status: Active; Minimum Order: 1; Number of Terminations: 2; Operating Temperature: -55°C ~ 155°C; Package / Case: 0603 (1608 Metric); Packaging: CutTape; PartId: 22600; Part Status: Active; Price: 0.01; Resistance: 1 kOhms; Series: RC_L; Size / Dimension: 0.063" L x 0.031" W (1.60mm x 0.80mm); Supplier 1: DigiKey; Supplier Part Number 1: 311-1.00KHRCT-ND; Supplier Device Package: 0603; Tolerance: ±1%
R2 R3 R6 R7 = RC0402FR-072K2L: RES 2.2K OHM 1% 1/16W 0402; Manufacturer: Yageo; Power (Watts): 0.063W, 1/16W; Temperature Coefficient: ±100ppm/°C; Part Number: RC0402FR-072K2L; Value: 2.2 kOhms; ComponentLink1Description: Datasheet; ComponentLink1URL: https://www.yageo.com/upload/media/product/productsearch/datasheet/rchip/PYu-RC_Group_51_RoHS_L_10.pdf; ComponentLink2Description: DigiKey Link; ComponentLink2URL: https://www.digikey.com/en/products/detail/yageo/RC0402FR-072K2L/726553; Composition: Thick Film; Device Package: 0402 (1005 Metric); Features: Moisture Resistant; Height - Seated (Max): 0.016" (0.40mm); LastUpdated: 25.07.2024 9:18:11; Lifecycle Status: Active; Minimum Order: 1; Number of Terminations: 2; Operating Temperature: -55°C ~ 155°C; Package / Case: 0402 (1005 Metric); Packaging: CutTape; PartId: 17607; Part Status: Active; Price: 0.01; Resistance: 2.2 kOhms; Series: RC_L; Size / Dimension: 0.039" L x 0.020" W (1.00mm x 0.50mm); Supplier 1: DigiKey; Supplier Part Number 1: 311-2.20KLRCT-ND; Supplier Device Package: 0402; Tolerance: ±1%
R4 R5 = RC0402FR-07470RL: RES 470 OHM 1% 1/16W 0402; Manufacturer: Yageo; Power (Watts): 0.063W, 1/16W; Temperature Coefficient: ±100ppm/°C; Packaging: CutTape; Composition: Thick Film; Tolerance: ±1%; Resistance: 470 Ohms; Value: 470 Ohms; Series: RC_L; Number of Terminations: 2; ComponentLink1URL: https://www.yageo.com/upload/media/product/productsearch/datasheet/rchip/PYu-RC_Group_51_RoHS_L_10.pdf; ComponentLink1Description: Datasheet; ComponentLink2URL: https://www.digikey.com/en/products/detail/yageo/RC0402FR-07470RL/726619; ComponentLink2Description: DigiKey Link; Part Number: RC0402FR-07470RL; Device Package: 0402 (1005 Metric); Features: Moisture Resistant; Height - Seated (Max): 0.016" (0.40mm); LastUpdated: 25.07.2024 9:18:11; Lifecycle Status: Active; Minimum Order: 1; Operating Temperature: -55°C ~ 155°C; Package / Case: 0402 (1005 Metric); PartId: 17923; Part Status: Active; Price: 0.01; Size / Dimension: 0.039" L x 0.020" W (1.00mm x 0.50mm); Supplier 1: DigiKey; Supplier Part Number 1: 311-470LRCT-ND; Supplier Device Package: 0402
TP1 TP2 = PAD_TEST: as TP3 on sheet GrandMini_v1; Case: {Case}
XP1 = BH2-08: Connector; Manufacturer_Name: Connfly; Manufacturer_Part_Number: DS1014-08; Manufacturer_Part_Number_1: IDC2-08MS; Datasheet Link: https://static.chipdip.ru/lib/463/DOC002463525.pdf; System: Connector